# Altium schematic sheet MODEM_power.SchDoc
size A3; PageSetup: Record=PageOptions|CenterHorizontal=True|CenterVertical=True|PrintScale=0.70|XCorrection=1.00|YCorrection=1.00|PrintKind=2|BorderSize=5000000|LeftOffset=0|BottomOffset=0|Orientation=2|PaperLength=1000|PaperWidth=1000|Scale=100|PaperSource=7|PrintQuality=-3|MediaType=1|DitherType=10|PrintScaleMode=1|PaperKind=A4|PaperIndex=9
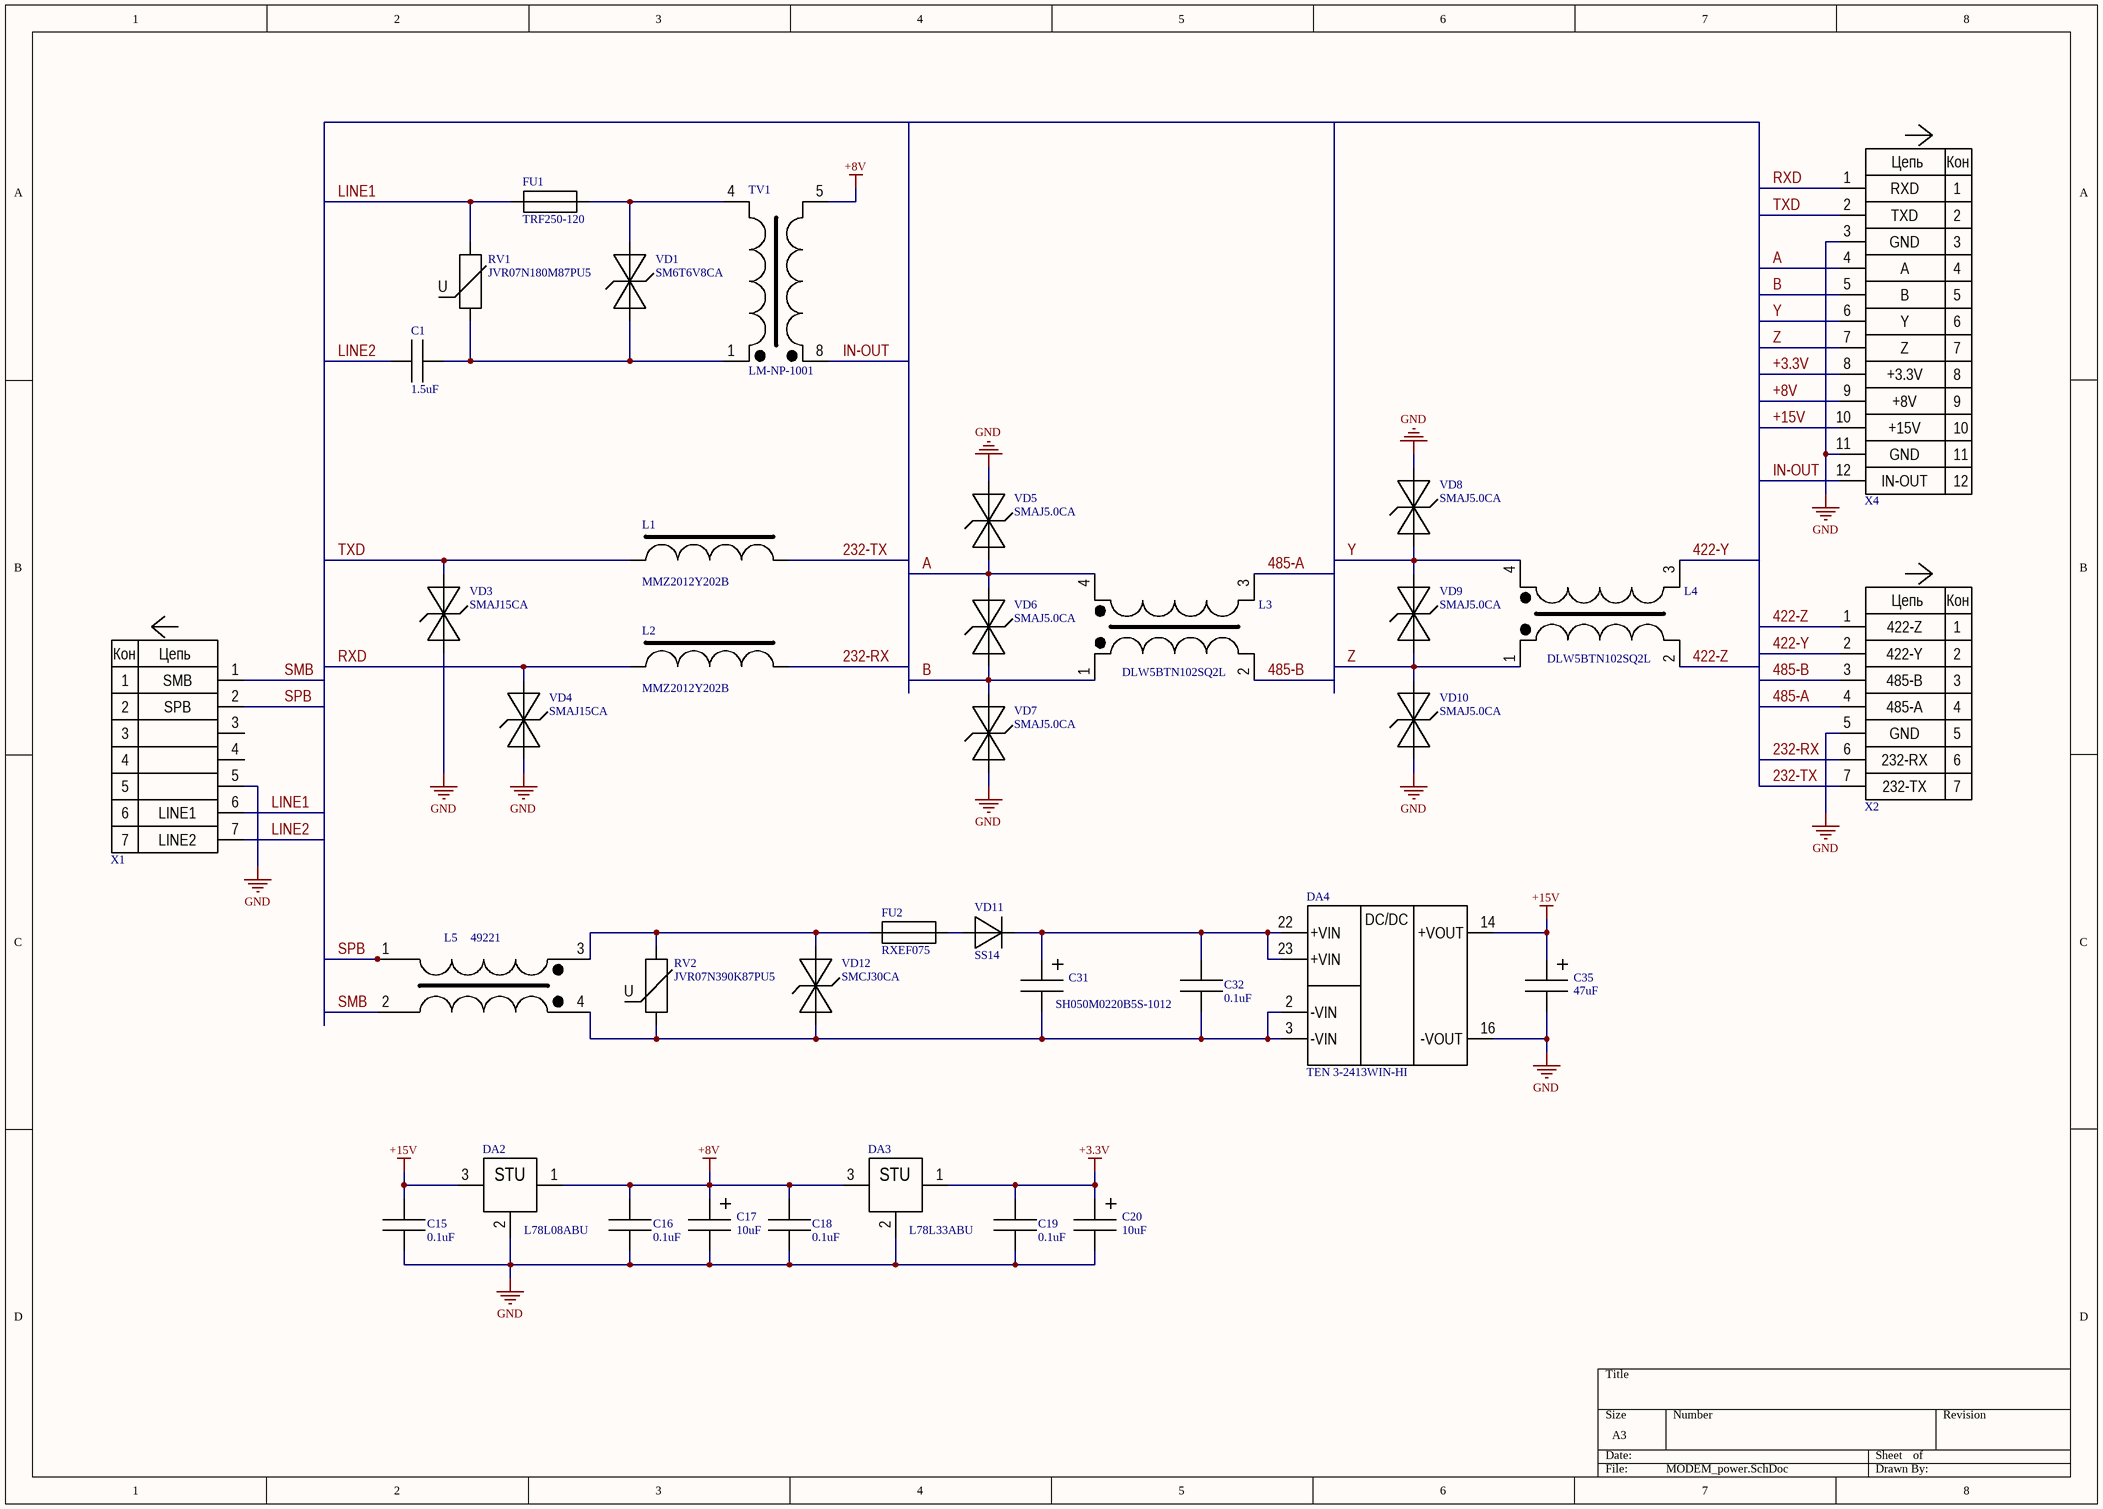
[diagram p0: MODEM_power.SchDoc]

## Parts
C1  1.5uF  [TS02-22.5-h]
C15  0.1uF  [CC0805]
C16  0.1uF  [CC0805]
C17  10uF  [SMB]
C18  0.1uF  [CC0805]
C19  0.1uF  [CC0805]
C20  10uF  [SMB]
C31  SH050M0220B5S-1012  [SH050-1019]
C32  0.1uF  [CC0805]
C35  47uF  [SMD]
DA2  L78L08ABU  [SOT-89]
DA3  L78L33ABU  [SOT-89]
DA4  TEN 3-2413WIN-HI  [TEN3-2412WIN]
FU1  TRF250-120  [TRF250-120]
FU2  RXEF075  [RXEF075]
L1  MMZ2012Y202B  [MMZ2012Y202B]
L2  MMZ2012Y202B  [MMZ2012Y202B]
L3  DLW5BTN102SQ2L  [DLW5BTN]
L4  DLW5BTN102SQ2L  [DLW5BTN]
L5  49221  [49221]
RV1  JVR07N180M87PU5  [JVR07N330]
RV2  JVR07N390K87PU5  [JVR07N330]
TV1  LM-NP-1001  [LM-NP-1001]
VD1  SM6T6V8CA  [SM6T6V8CA]
VD3  SMAJ15CA  [SMAJ6.0CA]
VD4  SMAJ15CA  [SMAJ6.0CA]
VD5  SMAJ5.0CA  [SMAJ6.0CA]
VD6  SMAJ5.0CA  [SMAJ6.0CA]
VD7  SMAJ5.0CA  [SMAJ6.0CA]
VD8  SMAJ5.0CA  [SMAJ6.0CA]
VD9  SMAJ5.0CA  [SMAJ6.0CA]
VD10  SMAJ5.0CA  [SMAJ6.0CA]
VD11  SS14  [SS14]
VD12  SMCJ30CA  [SMCJ28A]
X1  8113_S/07  [8113_S/07]  (value not drawn)
X2  8113_S/07  [8113_S/07]  (value not drawn)
X4  PLS-12  [PLS-12]  (value not drawn)

## Nets
+3.3V: C19.2 C20.2(A) DA3.1(OUT) X4.8
+8V: C16.2 C17.2(A) C18.2 DA2.1(OUT) DA3.3(IN) TV1.5 X4.9
+15V: C15.2 C35.2(A) DA2.3(IN) DA4.14(+VOUT) X4.10
GND: C15.1 C16.1 C17.1(C) C18.1 C19.1 C20.1(C) C35.1(C) DA2.2(GND) DA3.2(GND) DA4.16(-VOUT) VD3.1(A) VD4.1(A) VD5.2(С) VD7.1(A) VD8.2(С) VD10.1(A) X1.5 X2.5 X4.3 X4.11
232-RX: L2.2 X2.6
232-TX: L1.2 X2.7
422-Y: L4.3 X2.2
422-Z: L4.2 X2.1
485-A: L3.3 X2.4
485-B: L3.2 X2.3
A: L3.4 VD5.1(A) VD6.2(С) X4.4
B: L3.1 VD6.1(A) VD7.2(С) X4.5
IN-OUT: TV1.8 X4.12
LINE1: FU1.1 RV1.1 X1.6
LINE2: C1.1 X1.7
RXD: L2.1 VD4.2(С) X4.1
SMB: L5.2 X1.1
SPB: L5.1 X1.2
TXD: L1.1 VD3.2(С) X4.2
Y: L4.4 VD8.1(A) VD9.2(С) X4.6
Z: L4.1 VD9.1(A) VD10.2(С) X4.7
NetC1_2: C1.2 RV1.2 TV1.1 VD1.1(A)
NetC31_1: C31.1(C) C32.1 DA4.2(-VIN) DA4.3(-VIN) L5.4 RV2.2 VD12.1(A)
NetC31_2: C31.2(A) C32.2 DA4.22(+VIN) DA4.23(+VIN) VD11.2(С)
NetFU1_2: FU1.2 TV1.4 VD1.2(С)
NetFU2_1: FU2.1 L5.3 RV2.1 VD12.2(С)
NetFU2_2: FU2.2 VD11.1(A)

Not connected (* = marked no-connect by the designer): X1 3 4

## Notes on the sheet
- (near X4) RXD
- (near X4) TXD
- (near X4) GND
- (near X4) A
- (near X4) B
- (near X4) Y
- (near X4) Z
- (near X4) +3.3V
- (near X4) +8V
- (near X4) +15V
- (near X4) IN-OUT
- (near X2) 422-Z
- (near X2) 422-Y
- (near X1) SMB
- (near X1) SPB
- (near X2) 485-B
- (near X2) 485-A
- (near X2) GND
- (near X2) 232-RX
- (near X2) 232-TX
- (near X1) LINE1
- (near X1) LINE2
- (in symbol 8113_S/07) Кон; Цепь
- (in symbol JVR14N361) U
- (in symbol L78L08ABU) STU
- (in symbol L78L33ABU) STU
- (in symbol PLS-12) Цепь; Кон
- (in symbol TEN3-2412WIN) DC/DC

## Library data of the parts
C1 C15 C16 C18 C19 C32 = CC1206
C17 C20 C31 C35 = SR-6
DA4 = TEN3-2412WIN
FU2 = TRF250-120
L3 L4 = DLW31SN
RV1 RV2 = JVR14N361
VD3-VD10 = SMAJ6.0CA
VD12 = SM6T6V8CA